# EAGLE design r1_ar_0.1b (EAGLE 7.6.0)
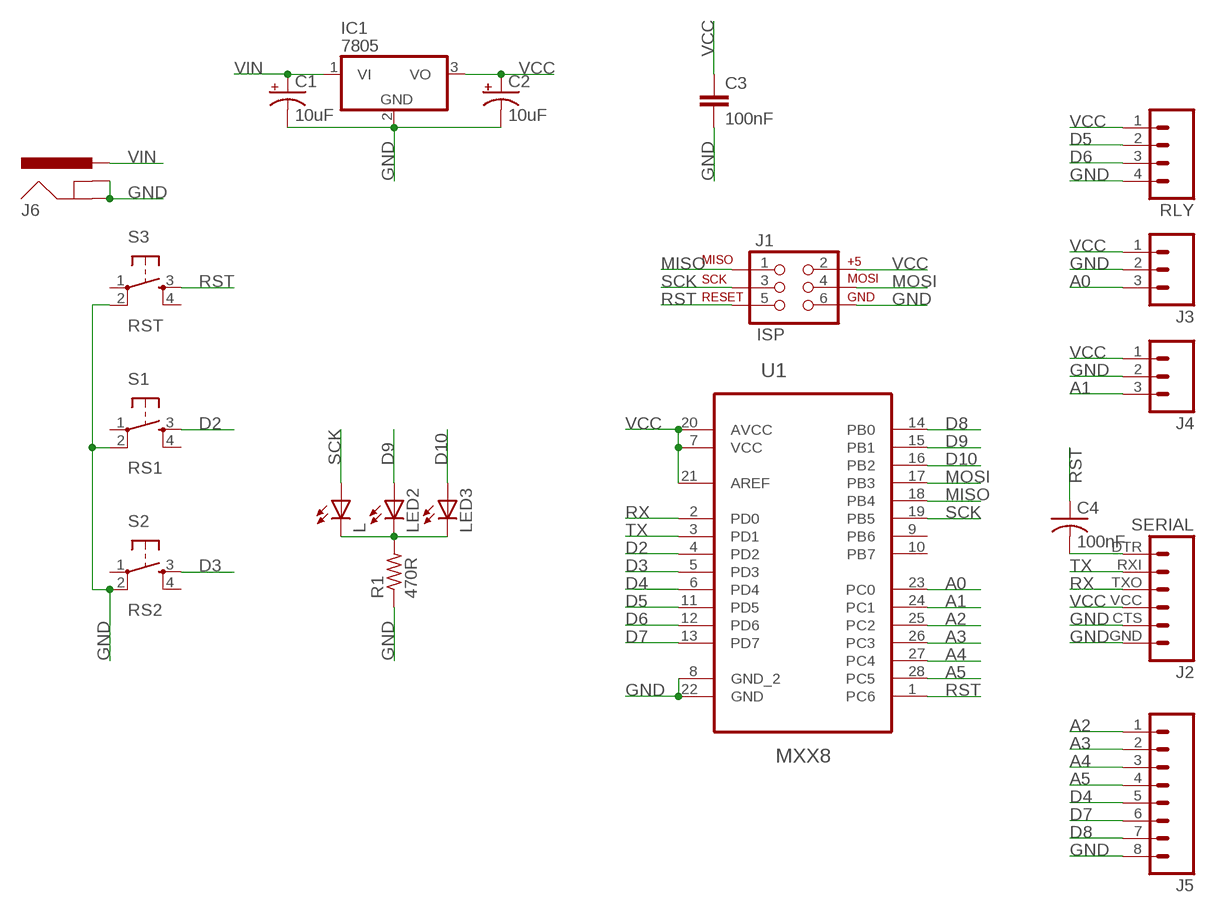
[diagram p0: schematic, sheet 1]

## Parts
C1  10uF  CPOL-US153CLV-0405  [153CLV-0405]
C2  10uF  CPOL-US153CLV-0405  [153CLV-0405]
C3  100nF  CAPPTH  [CAP-PTH-SMALL]
C4  100nF  C-USC1206K  [C1206K]
IC1  7805  7805TV  [TO220V]
J1  ISP  AVR_SPI_PRG_62X3_LOCK  [2X3_LOCK]
J2  SERIAL  FTDI_BASICPTH  [FTDI_BASIC]
J3  M03PTH  [1X03]
J4  M03PTH  [1X03]
J5  M08SILK_FEMALE_PTH  [1X08]
J6  POWER_JACKSLT  [POWER_JACK_SLOT]
L  LEDSML0805  [SML0805]
LED2  LEDSML0805  [SML0805]
LED3  LEDSML0805  [SML0805]
R1  470R  R-US_M0805  [M0805]
RLY  M04PTH  [1X04]
S1  RS1  TAC_SWITCHSMD  [TACTILE-SWITCH-SMD]
S2  RS2  TAC_SWITCHSMD  [TACTILE-SWITCH-SMD]
S3  RST  TAC_SWITCHSMD  [TACTILE-SWITCH-SMD]
U1  MXX8  ATMEGA88A-PU  [DIP254P762X457-28]

## Nets
A0: J3.3 U1.23(PC0)
A1: J4.3 U1.24(PC1)
A2: J5.1 U1.25(PC2)
A3: J5.2 U1.26(PC3)
A4: J5.3 U1.27(PC4)
A5: J5.4 U1.28(PC5)
D2: S1.3 U1.4(PD2)
D3: S2.3 U1.5(PD3)
D4: J5.5 U1.6(PD4)
D5: RLY.2 U1.11(PD5)
D6: RLY.3 U1.12(PD6)
D7: J5.6 U1.13(PD7)
D8: J5.7 U1.14(PB0)
D9: LED2.A U1.15(PB1)
D10: LED3.A U1.16(PB2)
GND: C1.- C2.- C3.2 IC1.2(GND) J1.6 J2.CTS J2.GND J3.2 J4.2 J5.8 J6.GND@1(GNDBREAK) J6.GND@2(GND) R1.1 RLY.4 S1.2 S2.2 S3.2 U1.8(GND_2) U1.22(GND)
MISO: J1.1 U1.18(PB4)
MOSI: J1.4 U1.17(PB3)
N$1: L.C LED2.C LED3.C R1.2
N$2: C4.2 J2.DTR
RST: C4.1 J1.5 S3.3 U1.1(PC6)
RX: J2.TXO U1.2(PD0)
SCK: J1.3 L.A U1.19(PB5)
TX: J2.RXI U1.3(PD1)
VCC: C2.+ C3.1 IC1.3(VO) J1.2 J2.VCC J3.1 J4.1 RLY.1 U1.7(VCC) U1.20(AVCC) U1.21(AREF)
VIN: C1.+ IC1.1(VI) J6.PWR
Unconnected: S1.1 S1.4 S2.1 S2.4 S3.1 S3.4 U1.9(PB6) U1.10(PB7)

## Library data of the parts
C1 C2 = rcl:CPOL-US: POLARIZED CAPACITOR, American symbol
C3 = SparkFun-Capacitors:CAP: Capacitor Standard 0603 ceramic capacitor, and 0.1" leaded capacitor.
C4 = resistor:C-US: CAPACITOR, American symbol
IC1 = linear:78*: Positive VOLTAGE REGULATOR Source: http://cache.national.com/ds/LM/LM78L05.pdf http://www.fairchildsemi.com/ds/LM/LM7805.pdf
J1 = SparkFun-Connectors:AVR_SPI_PRG_6: AVR ISP 6 Pin This is the reduced ISP connector for AVR programming. Common on Arduino. This footprint will take up less PCB space and can be used with a 10-pin to 6-pin adapter such as SKU: BOB-08508 **Special note about "TEST_POINT" package. The stop mask is on the top side, so if you want your programming test points to be on the bottom of your board, make sure to place this package on the bottom side of the board. This also ensure that the orientation to program from the bottom side will be correct.
J2 = SparkFun-Connectors:FTDI_BASIC: FTDI Basic header with labels
J3 J4 = SparkFun-Connectors:M03: Header 3 Standard 3-pin 0.1" header. Use with straight break away headers (SKU : PRT-00116), right angle break away headers (PRT-00553), swiss pins (PRT-00743), machine pins (PRT-00117), and female headers (PRT-00115). Molex polarized connector foot print use with SKU : PRT-08232 with associated crimp pins and housings.
J5 = SparkFun-Connectors:M08: Header 8 Standard 8-pin 0.1" header. Use with straight break away headers (SKU : PRT-00116), right angle break away headers (PRT-00553), swiss pins (PRT-00743), machine pins (PRT-00117), and female headers (PRT-00115).; PROD_ID: CONN-08438
J6 = SparkFun-Connectors:POWER_JACK: Power Jack This is the standard 5.5mm barrel jack for power. The PTH is the most common, proven, reliable, footprint. The Slot footprint only works if the mill layer is transmitted to the PCB fab house so be warned. Mating wall wart : TOL-00298 (and others); PROD_ID: PRT-00119
L LED2 LED3 = led:LED: LED OSRAM: - CHIPLED LG R971, LG N971, LY N971, LG Q971, LY Q971, LO R971, LY R971 LH N974, LH R974 LS Q976, LO Q976, LY Q976 LO Q996 - Hyper CHIPLED LW Q18S LB Q993, LB Q99A, LB R99A - SideLED LS A670, LO A670, LY A670, LG A670, LP A670 LB A673, LV A673, LT A673, LW A673 LH A674 LY A675 LS A676, LA A676, LO A676, LY A676, LW A676 LS A679, LY A679, LG A679 - Hyper Micro SIDELED® LS Y876, LA Y876, LO Y876, LY Y876 LT Y87S - SmartLED LW L88C, LW L88S LB L89C, LB L89S, LG L890 LS L89K, LO L89K, LY L89K LS L896, LA L896, LO L896, LY L896 - TOPLED LS T670, LO T670, LY T670, LG T670, LP T670 LSG T670, LSP T670, LSY T670, LOP T670, LYG T670 LG T671, LOG T671, LSG T671 LB T673, LV T673, LT T673, LW T673 LH T674 LS T676, LA T676, LO T676, LY T676, LB T676, LH T676, LSB T676, LW T676 LB T67C, LV T67C, LT T67C, LS T67K, LO T67K, LY T67K, LW E67C LS E67B, LA E67B, LO E67B, LY E67B, LB E67C, LV E67C, LT E67C LW T67C LS T679, LY T679, LG T679 LS T770, LO T770, LY T770, LG T770, LP T770 LB T773, LV T773, LT T773, LW T773 LH T774 LS E675, LA E675, LY E675, LS T675 LS T776, LA T776, LO T776, LY T776, LB T776 LHGB T686 LT T68C, LB T68C - Hyper Mini TOPLED® LB M676 - Mini TOPLED Santana® LG M470 LS M47K, LO M47K, LY M47K Source: http://www.osram.convergy.de LUXEON: - LUMILED® LXK2-PW12-R00, LXK2-PW12-S00, LXK2-PW14-U00, LXK2-PW14-V00 LXK2-PM12-R00, LXK2-PM12-S00, LXK2-PM14-U00 LXK2-PE12-Q00, LXK2-PE12-R00, LXK2-PE12-S00, LXK2-PE14-T00, LXK2-PE14-U00 LXK2-PB12-K00, LXK2-PB12-L00, LXK2-PB12-M00, LXK2-PB14-N00, LXK2-PB14-P00, LXK2-PB14-Q00 LXK2-PR12-L00, LXK2-PR12-M00, LXK2-PR14-Q00, LXK2-PR14-R00 LXK2-PD12-Q00, LXK2-PD12-R00, LXK2-PD12-S00 LXK2-PH12-R00, LXK2-PH12-S00 LXK2-PL12-P00, LXK2-PL12-Q00, LXK2-PL12-R00 Source: www.luxeon.com KINGBRIGHT: KA-3528ASYC Source: www.kingbright.com
R1 = resistor:R-US_: RESISTOR, American symbol
RLY = SparkFun-Connectors:M04: Header 4 Standard 4-pin 0.1" header. Use with straight break away headers (SKU : PRT-00116), right angle break away headers (PRT-00553), swiss pins (PRT-00743), machine pins (PRT-00117), and female headers (PRT-00115). Molex polarized connector foot print use with SKU : PRT-08231 with associated crimp pins and housings. 1MM SMD Version SKU: PRT-10208; PROD_ID: CONN-09696
S1-S3 = SparkFun-Retired:TAC_SWITCH: Momentary Switch Button commonly used for reset or general input. Spark Fun Electronics SKU : COM-00097 SMT- SWCH-08247; PROD_ID: SWCH-08247; VALUE: TAC_SWITCHSMD
U1 = atmega88a-pu:ATMEGA88A-PU: MCU; MPN: ATMEGA88A-PU; OC_FARNELL: 1841615; OC_NEWARK: 68T3267; PACKAGE: DIP-28; SUPPLIER: Atmel

## Board
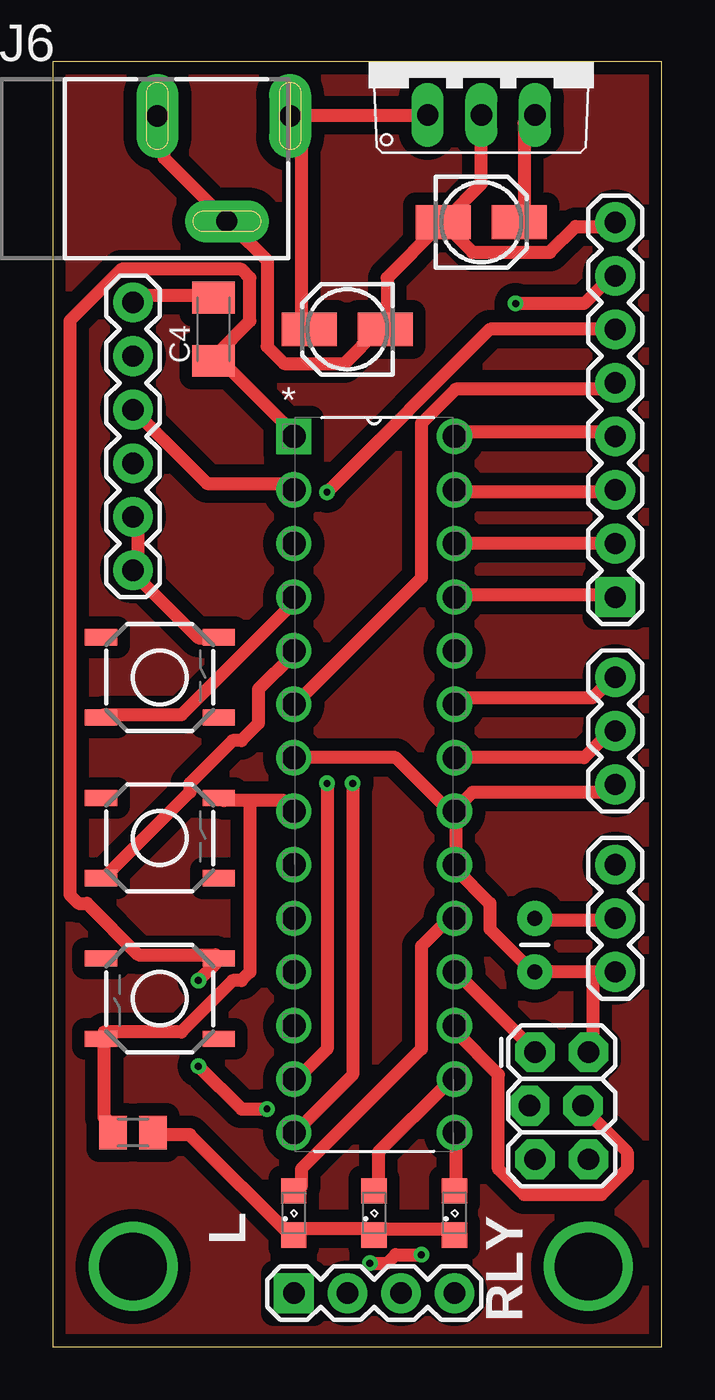
[diagram p1: board, top side]
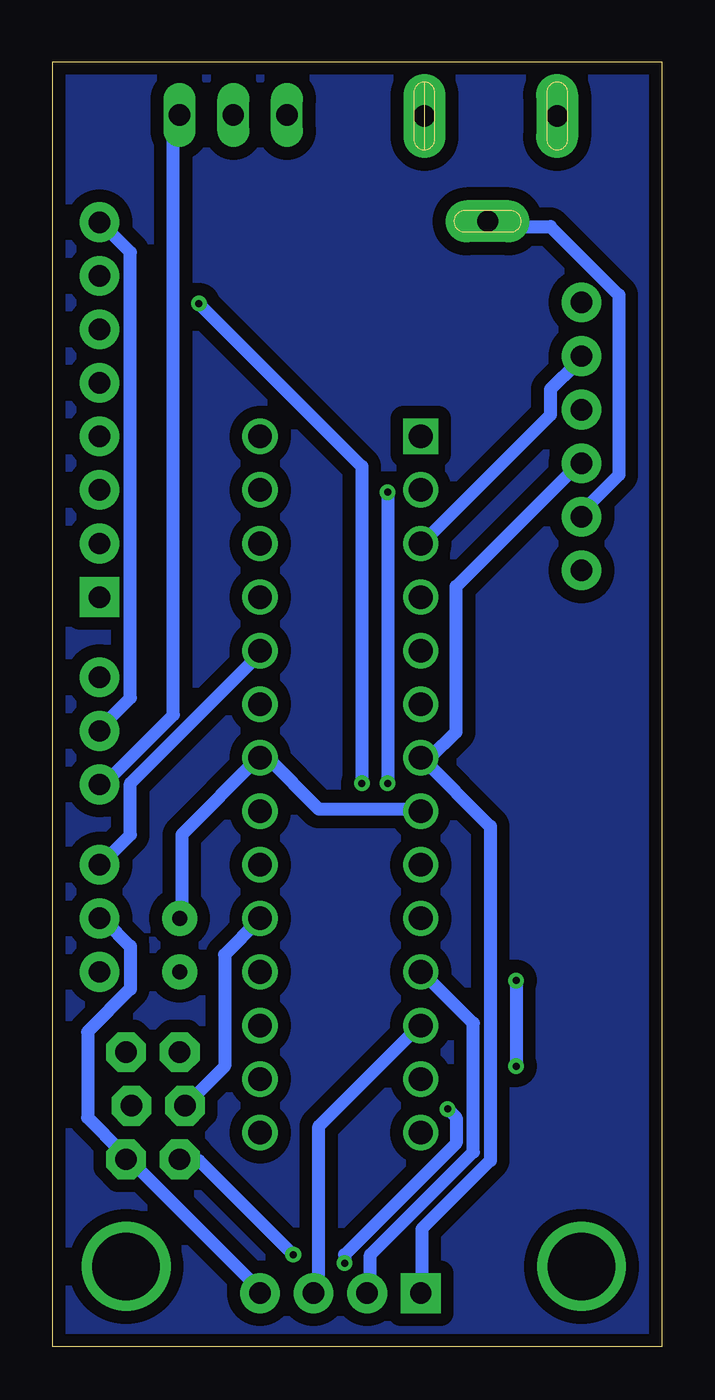
[diagram p2: board, bottom side, seen from below]

Size 28.88 x 60.95 mm. Coordinates in mm from the lower left corner, seen from the top.
Outline: 0,0 28.88,0 28.88,60.95 0,60.95 0,0
Copper layers (1*16): Top 0.035mm / dielectric 1.5mm / Bottom 0.035mm
Design rules "oshpark_pwr-sig_mix": minimum track width 24mil, minimum drill 13mil, track to track 8mil, track to pad 8mil, pad to pad 8mil, via to via 8mil, smd to smd 8mil, copper to edge 18mil, drill to drill 8mil, minimum pad ring 10mil, minimum via ring 8mil, stop-mask expansion 4mil, vias tented up to drill 0mil, thermal gap 10mil

### Footprints (pad centres in the part's own frame; a part is rotated, then mirrored left to right if it is on the bottom)
153CLV-0405 = smd 2.6 x 1.6: + 1.8,0; - -1.8,0
CAP-PTH-SMALL = drill 0.7 pad 1.651: 1 0,0; 2 2.54,0
C1206K = smd 1.5 x 2: 1 -1.5,0; 2 1.5,0
TO220V = drill 1.016 long: 1 -2.54,-2.54; 2 0,-2.54; 3 2.54,-2.54
2X3_LOCK = drill 1.016 pad 1.88 octagon: 1 0,0; 2 0,2.54; 3 2.54,-0.254; 4 2.54,2.286; 5 5.08,0; 6 5.08,2.54
FTDI_BASIC = drill 1.016 pad 1.88: CTS 10.16,0; DTR 0,0; GND 12.7,0; RXI 2.54,0; TXO 5.08,0; VCC 7.62,0
1X03 = drill 1.016 pad 1.88: 1 0,0; 2 2.54,0; 3 5.08,0
1X08 = drill 1.016 pad 1.88 square: 1 0,0 | drill 1.016 pad 1.88: 2 2.54,0; 3 5.08,0; 4 7.62,0; 5 10.16,0; 6 12.7,0; 7 15.24,0; 8 17.78,0
POWER_JACK_SLOT = drill 1 pad 2 long: GND@1 2.58,7.5; GND@2 7.58,10.8; PWR 2.58,13.8
SML0805 = smd 1.2 x 1.2: A 1.05,0; C -1.05,0
M0805 = smd 1.3 x 1.6: 1 -0.95,0; 2 0.95,0
1X04 = drill 1.016 pad 1.88 square: 1 0,0 | drill 1.016 pad 1.88: 2 2.54,0; 3 5.08,0; 4 7.62,0
TACTILE-SWITCH-SMD = smd 1.524 x 0.762: 1 -2.794,1.905; 2 2.794,1.905; 3 -2.794,-1.905; 4 2.794,-1.905
DIP254P762X457-28 = drill 1.118 square: 1 -7.62,33.02 | drill 1.118: 2 -7.62,30.48; 3 -7.62,27.94; 4 -7.62,25.4; 5 -7.62,22.86; 6 -7.62,20.32; 7 -7.62,17.78; 8 -7.62,15.24; 9 -7.62,12.7; 10 -7.62,10.16; 11 -7.62,7.62; 12 -7.62,5.08; 13 -7.62,2.54; 14 -7.62,0; 15 0,0; 16 0,2.54; 17 0,5.08; 18 0,7.62; 19 0,10.16; 20 0,12.7; 21 0,15.24; 22 0,17.78; 23 0,20.32; 24 0,22.86; 25 0,25.4; 26 0,27.94; 27 0,30.48; 28 0,33.02

### Placement (x,y rotation side)
C1  13.97,48.26 180 top
C2  20.32,53.34 0 top
C3  22.86,17.78 90 top
C4  7.62,48.26 90 top
IC1  20.32,60.96 0 top
J1  22.86,13.97 270 top
J2  3.81,49.53 270 top
J3  26.67,26.67 90 top
J4  26.67,17.78 90 top
J5  26.67,35.56 90 top
J6  -2.54,60.96 270 top
L  11.43,6.35 90 top
LED2  19.05,6.35 90 top
LED3  15.24,6.35 90 top
R1  3.81,10.16 0 top
RLY  11.43,2.54 0 top
S1  5.08,31.75 0 top
S2  5.08,24.13 0 top
S3  5.08,16.51 180 top
U1  19.05,10.16 0 top

### Tracks (layer width: path | path; a pad name or v marks a point on that pad's centre or on a via)
A0
  Top 0.61: U1.23 19.1,30.79 25.6,30.79 26.42,31.6 J3.3
A1
  Bottom 0.61: U1.24 19.1,32.82 25.2,26.72 25.2,24.28 26.42,23.06 J4.3
A2
  Top 0.61: U1.25 19.1,35.66 26.42,35.66 J5.1
A3
  Top 0.61: J5.2 U1.26
A4
  Top 0.61: U1.27 19.1,40.54 26.42,40.54 J5.3
A5
  Top 0.61: U1.28 19.1,43.38 26.42,43.38 J5.4
D2
  Top 0.61: S1.3 2.44,29.97 6.1,29.97 11.38,35.26 U1.4
D3
  Top 0.61: S2.3 2.44,22.25 6.5,26.31 6.5,26.72 8.53,28.75 8.94,28.75 9.75,29.57 9.75,31.19 11.38,32.82 U1.5
D4
  Top 0.61: U1.6 11.79,30.79 17.48,36.47 17.48,43.79 19.1,45.41 26.42,45.41 J5.5
D5
  Bottom 0.61: U1.11 11.38,17.78 8.94,15.34 8.94,9.25 13.82,4.37 13.82,2.74 RLY.2
D6
  Bottom 0.61: U1.12 11.79,14.94 16.26,10.46 16.26,2.74 RLY.3
D7  (via drill 0.33)
  Top 0.61: v13.01,26.72 13.01,14.12 11.79,12.9 U1.13 | v13.01,40.54 20.73,48.26 J5.6
  Bottom 0.61: v13.01,40.54 v13.01,26.72
D8  (via drill 0.33)
  Top 0.61: v14.22,26.72 14.22,12.9 11.79,10.46 U1.14 | v21.95,49.48 25.2,49.48 26.42,50.7 J5.7
  Bottom 0.61: v14.22,26.72 14.22,41.76 v21.95,49.48
D9
  Top 0.61: LED2.A 19.1,7.62 19.1,10.06 U1.15
D10
  Top 0.61: LED3.A 15.44,7.62 15.44,9.25 18.69,12.5 U1.16
GND
  Top 0.61: C2.- 18.29,53.14 15.85,50.7 15.85,48.26 C1.- 15.44,48.26 13.82,46.63 10.97,46.63 10.16,47.45 10.16,51.51 8.53,53.14 J6.GND@2 8.13,53.54 5.28,56.39 5.28,58.01 J6.GND@1 | IC1.2 20.32,55.17 18.69,53.54 C2.- | J5.8 26.42,53.14 24.79,53.14 23.57,51.92 19.91,51.92 18.69,53.14 C2.- | S1.2 7.72,33.63 6.91,33.63 4.06,36.47 J2.GND 4.06,36.88 4.06,39.32 J2.CTS | R1.1 2.85,10.46 2.44,10.87 2.44,14.53 S3.2 2.44,14.94 6.1,14.94 8.53,17.37 8.94,17.37 9.35,17.78 9.35,25.91 | 9.35,25.91 10.97,25.91 11.38,25.5 U1.8 | 9.35,25.91 8.13,25.91 S2.2 | C3.2 23.16,20.22 26.42,20.22 J4.2 | U1.22 25.2,27.94 26.42,29.16 J3.2
  Bottom 0.61: J2.CTS 3.66,39.73 2.03,41.35 2.03,49.89 5.28,53.14 8.13,53.14 J6.GND@2 | RLY.4 19.1,2.74 25.2,8.84 J1.6 25.6,9.25 27.23,10.87 27.23,14.94 25.2,16.97 25.2,19 26.42,20.22 J4.2 | C3.2 22.76,20.62 22.76,24.28 19.1,27.94 U1.22 18.69,27.94 16.26,25.5 11.79,25.5 U1.8 | J5.8 26.42,53.14 25.2,51.92 25.2,30.79 26.42,29.57 J3.2
MISO
  Top 0.61: U1.18 19.1,17.78 22.76,14.12 J1.1
MOSI
  Top 0.61: U1.17 19.1,14.94 21.13,12.9 21.13,8.43 22.35,7.21 26.01,7.21 27.23,8.43 27.23,9.25 25.2,11.28 J1.4
N$1
  Top 0.61: LED2.C 18.69,5.59 15.44,5.59 LED3.C 15.04,5.59 11.79,5.59 L.C 11.38,5.18 6.5,10.06 4.88,10.06 R1.2
N$2
  Top 0.61: C4.2 7.32,49.89 4.06,49.89 J2.DTR
N$3
  pour Top (isolate 0.61): 0,60.96 29.21,60.96 29.21,0 0,0
N$4  (via drill 3.2)
  other vias: 3.81,3.81
N$5  (via drill 3.2)
  other vias: 25.4,3.81
N$6
  pour Bottom (isolate 0.61): 0,60.96 29.21,60.96 29.21,0 0,0
RST  (via drill 0.33)
  Top 0.61: 7.72,47.04 9.35,48.67 9.35,50.7 8.94,51.11 3.25,51.11 0.81,48.67 0.81,21.44 1.22,21.03 1.63,21.03 4.06,18.59 7.72,18.59 S3.3 7.72,18.19 v6.91,17.37 | 7.72,47.04 11.38,43.38 U1.1 | 7.72,47.04 C4.1 | v17.48,4.37 16.26,4.37 15.85,3.96 v15.04,3.96 | v10.16,11.28 8.94,11.28 v6.91,13.31
  Bottom 0.61: v17.48,4.37 21.95,8.84 22.76,8.84 J1.5 | v15.04,3.96 15.04,4.37 9.75,9.65 9.75,10.87 v10.16,11.28 | v6.91,17.37 v6.91,13.31
RX
  Top 0.61: J2.TXO 7.32,40.95 11.38,40.95 U1.2
SCK
  Top 0.61: L.A 11.79,7.62 11.79,8.43 17.48,14.12 17.48,19 18.69,20.22 U1.19
  Bottom 0.61: J1.3 20.73,13.31 20.73,18.59 19.1,20.22 U1.19
TX
  Bottom 0.61: U1.3 11.38,38.1 5.28,44.2 5.28,45.41 4.06,46.63 J2.RXI
VCC
  Top 0.61: J4.1 25.6,17.78 | 25.6,17.78 C3.1 22.76,17.78 20.73,19.81 20.73,21.03 19.1,22.66 U1.20 19.1,23.06 19.1,25.1 U1.21 | 25.6,17.78 25.6,14.12 J1.2 | C2.+ 22.35,53.54 22.35,58.01 22.76,58.42 IC1.3 | U1.7 16.26,27.94 18.69,25.5 U1.21 | J3.1 26.42,26.31 19.91,26.31 19.1,25.5 U1.21
  Bottom 0.61: RLY.1 11.38,2.74 11.38,5.59 8.13,8.84 8.13,24.69 11.38,27.94 U1.7 10.97,27.94 9.75,29.16 9.75,36.07 4.06,41.76 J2.VCC | IC1.3 23.16,58.42 23.16,29.97 26.42,26.72 J3.1
VIN
  Top 0.61: C1.+ 11.79,48.26 11.79,57.61 11.38,58.01 J6.PWR 11.38,58.42 IC1.1

### Text on the board
bStop: Henry Jeynes | Hydro 0.1b | C 2016